# EAGLE design SparkFun_SSOP28-DIP-Adapter-v12 (EAGLE 7.2.0)
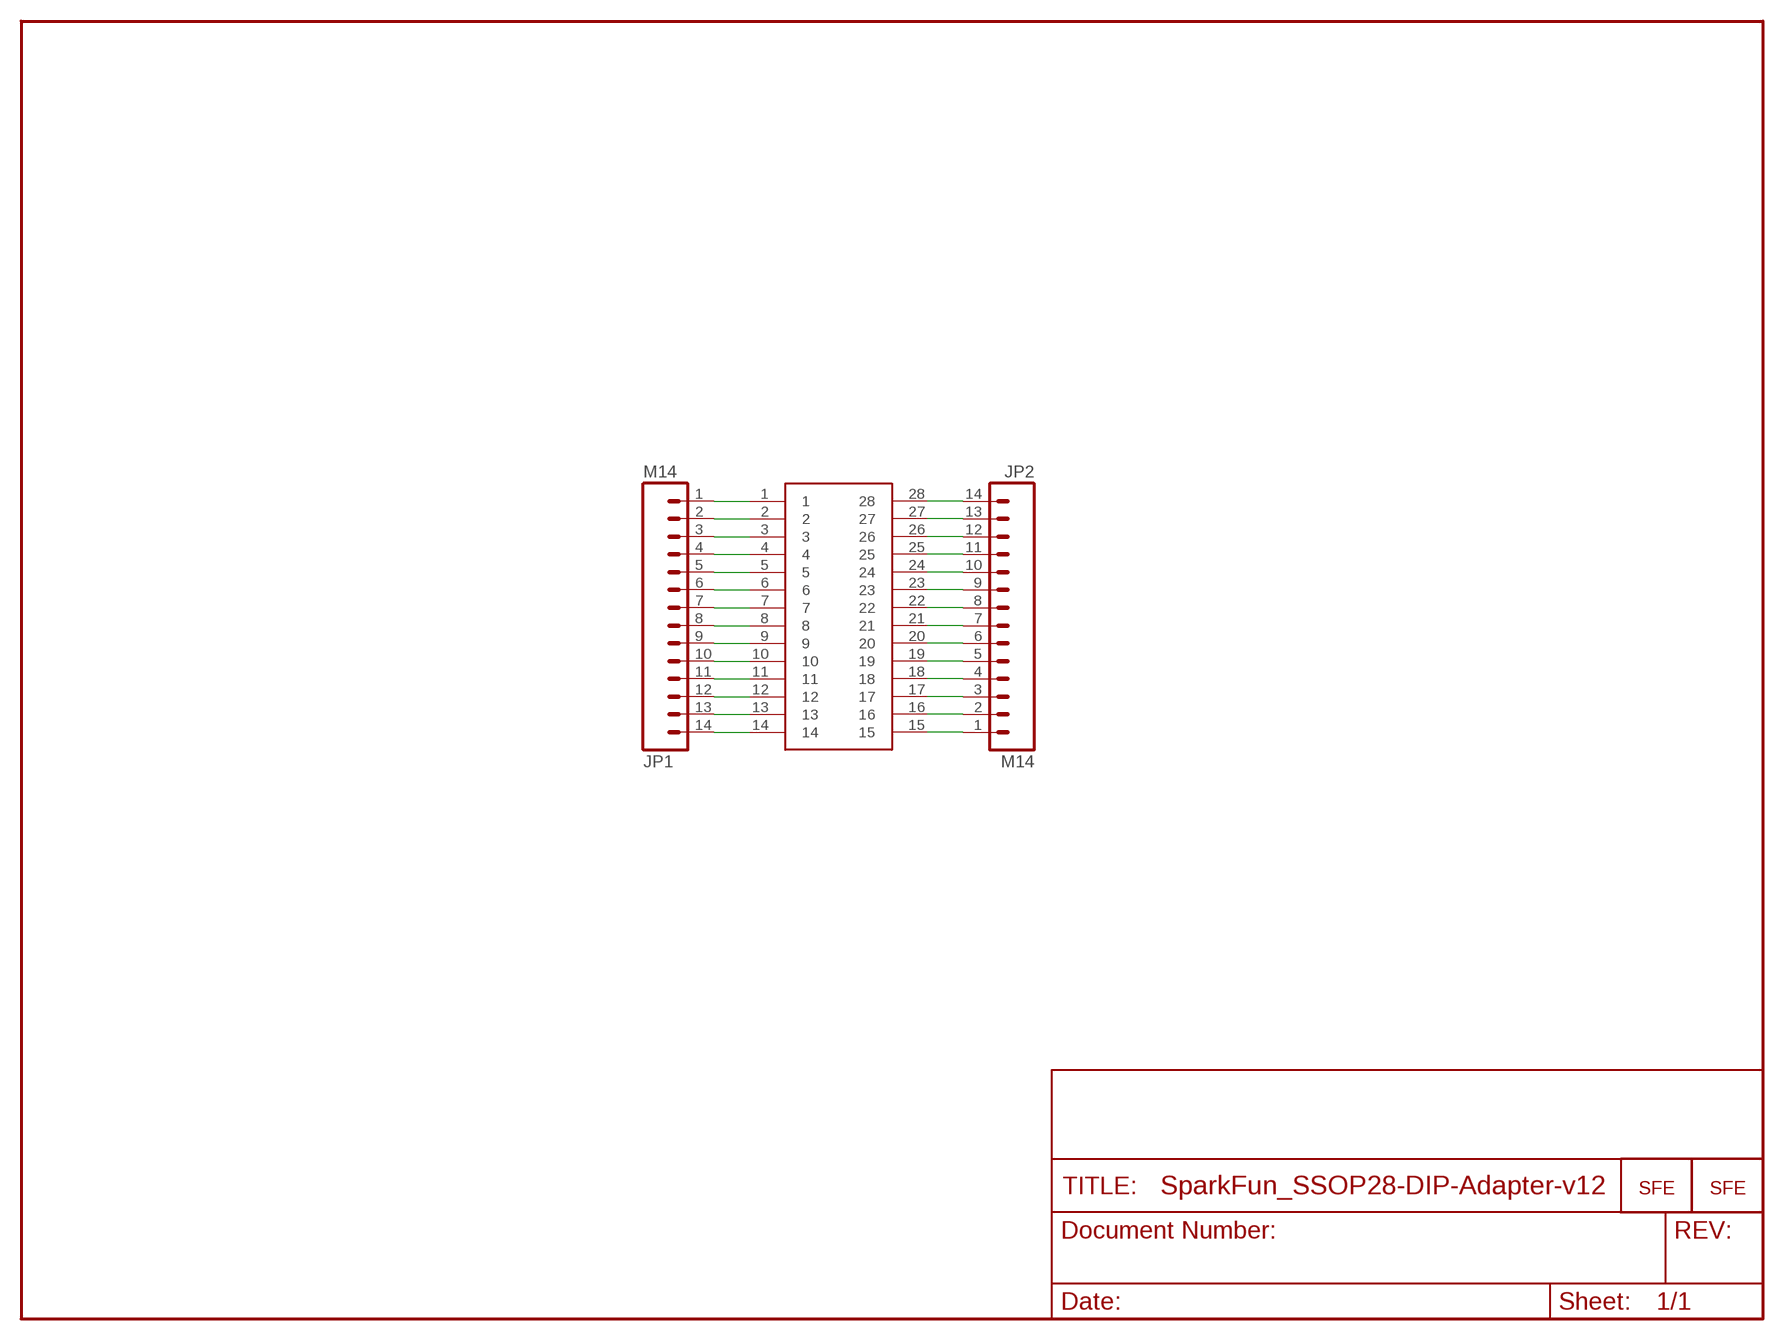
[diagram p0: schematic, sheet 1]

## Parts
JP1  M14  [1X14]
JP2  M14  [1X14]
U$1  LOGO-SFESK  [SFE-LOGO-FLAME]
U$2  SSOP28  [SSOP28DB]
U$5  LOGO-SFENEW  [SFE-NEW-WEBLOGO]

## Nets
N$1: JP2.1 U$2.15
N$2: JP2.2 U$2.16
N$3: JP2.3 U$2.17
N$4: JP2.4 U$2.18
N$5: JP2.5 U$2.19
N$6: JP2.6 U$2.20
N$7: JP2.7 U$2.21
N$8: JP2.8 U$2.22
N$9: JP2.9 U$2.23
N$10: JP2.10 U$2.24
N$11: JP2.11 U$2.25
N$12: JP2.12 U$2.26
N$13: JP2.13 U$2.27
N$14: JP2.14 U$2.28
N$15: JP1.1 U$2.1
N$16: JP1.2 U$2.2
N$17: JP1.3 U$2.3
N$18: JP1.4 U$2.4
N$19: JP1.5 U$2.5
N$20: JP1.6 U$2.6
N$21: JP1.7 U$2.7
N$22: JP1.8 U$2.8
N$23: JP1.9 U$2.9
N$24: JP1.10 U$2.10
N$25: JP1.11 U$2.11
N$26: JP1.12 U$2.12
N$27: JP1.13 U$2.13
N$28: JP1.14 U$2.14

## Library data of the parts
JP1 JP2 = SparkFun:M14: Header 14 Standard 14-pin 0.1" header. Use with straight break away headers (SKU : PRT-00116), right angle break away headers (PRT-00553), swiss pins (PRT-00743), machine pins (PRT-00117), and female headers (PRT-00115).
U$1 U$5 = SparkFun:LOGO-SFE: Spark Fun Electronics PCB Logo This is the standard Spark Fun Electronics PCB logo.
U$2 = SparkFun:SSOP28

## Board
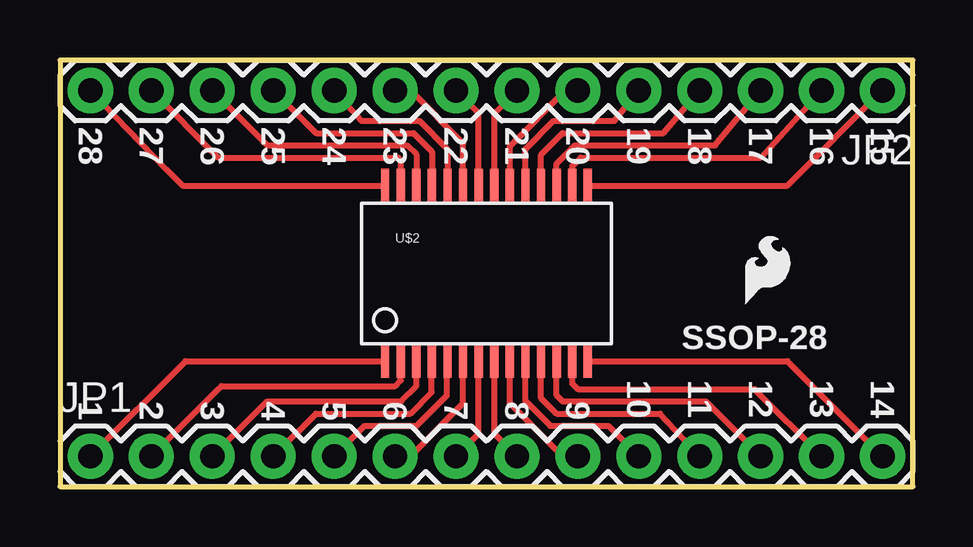
[diagram p1: board, top side]
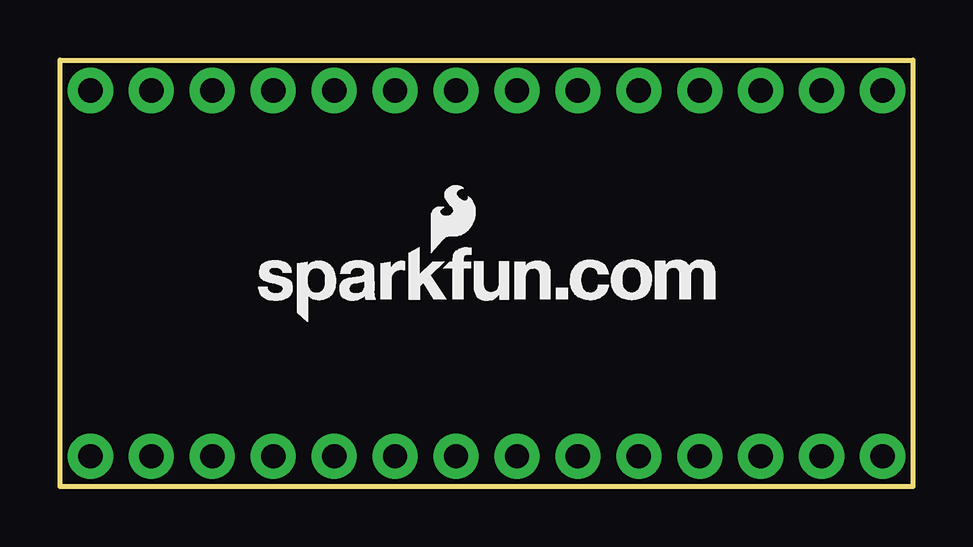
[diagram p2: board, bottom side, seen from below]

Size 35.56 x 17.78 mm. Coordinates in mm from the lower left corner, seen from the top.
Outline: 0,0 35.56,0 35.56,17.78 0,17.78 0,0
Copper layers (1*16): Top 0.035mm / dielectric 1.5mm / Bottom 0.035mm
Design rules "SparkFun": minimum track width 8mil, minimum drill 20mil, track to track 8mil, track to pad 8mil, pad to pad 8mil, via to via 8mil, smd to smd 8mil, copper to edge 10mil, drill to drill 8mil, minimum pad ring 12mil, minimum via ring 10mil, stop-mask expansion 4mil, vias tented up to drill 25mil, thermal gap 10mil

### Footprints (pad centres in the part's own frame; a part is rotated, then mirrored left to right if it is on the bottom)
1X14 = drill 1.016 pad 1.88: 1 0,0; 2 2.54,0; 3 5.08,0; 4 7.62,0; 5 10.16,0; 6 12.7,0; 7 15.24,0; 8 17.78,0; 9 20.32,0; 10 22.86,0; 11 25.4,0; 12 27.94,0; 13 30.48,0; 14 33.02,0
SSOP28DB = smd 0.348 x 1.397: 1 -4.225,-3.656; 2 -3.575,-3.656; 3 -2.925,-3.656; 4 -2.275,-3.656; 5 -1.625,-3.656; 6 -0.975,-3.656; 7 -0.325,-3.656; 8 0.325,-3.656; 9 0.975,-3.656; 10 1.625,-3.656; 11 2.275,-3.656; 12 2.925,-3.656; 13 3.575,-3.656; 14 4.225,-3.656; 15 4.225,3.656; 16 3.575,3.656; 17 2.925,3.656; 18 2.275,3.656; 19 1.625,3.656; 20 0.975,3.656; 21 0.325,3.656; 22 -0.325,3.656; 23 -0.975,3.656; 24 -1.625,3.656; 25 -2.275,3.656; 26 -2.925,3.656; 27 -3.575,3.656; 28 -4.225,3.656

### Placement (x,y rotation side)
JP1  1.27,1.27 0 top
JP2  34.29,16.51 180 top
U$1  28.57,7.62 0 top
U$2  17.78,8.89 0 top
U$5  27.3,6.86 0 bottom

### Tracks (layer width: path | path; a pad name or v marks a point on that pad's centre or on a via)
N$1
  Top 0.254: JP2.1 30.33,12.55 U$2.15
N$2
  Top 0.254: JP2.2 29.21,13.72 21.72,13.72 21.36,13.35 U$2.16
N$3
  Top 0.254: JP2.3 27.3,14.22 21.46,14.22 20.7,13.47 U$2.17
N$4
  Top 0.254: JP2.4 25.15,14.73 20.95,14.73 20.05,13.83 U$2.18
N$5
  Top 0.254: JP2.5 23.11,15.24 20.57,15.24 19.41,14.07 U$2.19
N$6
  Top 0.254: U$2.20 18.75,14.18 21.08,16.51 JP2.6
N$7
  Top 0.254: U$2.21 18.11,15.56 JP2.7
N$8
  Top 0.254: U$2.22 17.45,15.56 JP2.8
N$9
  Top 0.254: JP2.9 14.61,16.51 16.8,14.31 U$2.23
N$10
  Top 0.254: JP2.10 12.57,15.24 14.99,15.24 16.16,14.07 U$2.24
N$11
  Top 0.254: JP2.11 10.67,14.73 14.73,14.73 15.51,13.96 U$2.25
N$12
  Top 0.254: JP2.12 8.64,14.22 14.48,14.22 14.86,13.85 U$2.26
N$13
  Top 0.254: U$2.27 14.21,13.61 14.1,13.72 6.6,13.72 JP2.13
N$14
  Top 0.254: JP2.14 4.45,13.21 5.11,12.55 U$2.28
N$15
  Top 0.254: JP1.1 5.23,5.23 U$2.1
N$16
  Top 0.254: JP1.2 6.54,4 | 6.54,4 6.6,4.06 | U$2.2 14.21,4.43 13.97,4.19 6.73,4.19 6.54,4
N$17
  Top 0.254: JP1.3 8.64,3.56 14.22,3.56 14.86,4.19 U$2.3
N$18
  Top 0.254: JP1.4 10.67,3.05 14.61,3.05 15.49,3.94 15.49,5.22 U$2.4
N$19
  Top 0.254: JP1.5 12.7,2.54 14.86,2.54 16.13,3.81 16.13,5.21 U$2.5
N$20
  Top 0.254: U$2.6 16.8,3.47 14.61,1.27 JP1.6
N$21
  Top 0.254: U$2.7 17.45,2.21 JP1.7
N$22
  Top 0.254: U$2.8 18.11,2.21 JP1.8
N$23
  Top 0.254: U$2.9 18.75,3.47 20.7,1.52 JP1.9
N$24
  Top 0.254: U$2.10 19.41,3.58 20.45,2.54 22.86,2.54 JP1.10
N$25
  Top 0.254: U$2.11 20.05,3.69 20.7,3.05 25.02,3.05 JP1.11
N$26
  Top 0.254: U$2.12 20.7,3.81 20.95,3.56 26.92,3.56 JP1.12
N$27
  Top 0.254: JP1.13 28.96,4.06 21.59,4.06 21.36,4.3 U$2.13
N$28
  Top 0.254: JP1.14 30.33,5.23 U$2.14

### Text on the board
tPlace: 28 | 27 | 26 | 25 | 24 | 23 | 22 | 21 | 20 | 19 | 18 | 17 | 16 | 15 | SSOP-28 | 1 | 2 | 3 | 4 | 5 | 6 | 7 | 8 | 9 | 10 | 11 | 12 | 13 | 14